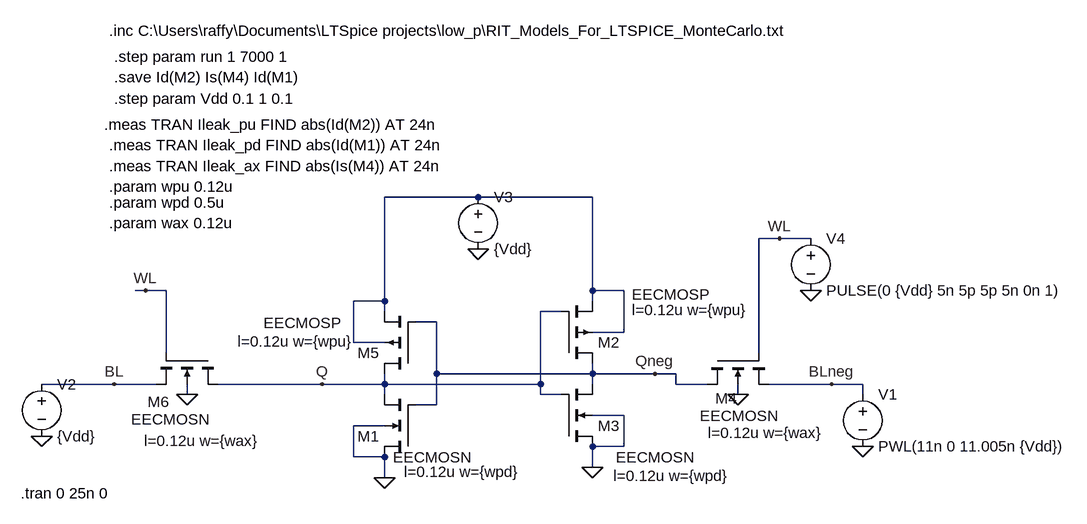
[diagram p0: schematic 6tcell_leak.asc]
6tcell_leak.asc, the LTspice schematic file:
Version 4
SHEET 1 1532 836
WIRE 624 112 480 112
WIRE 800 112 624 112
WIRE 1088 176 1056 176
WIRE 1136 176 1088 176
WIRE 112 256 96 256
WIRE 144 256 112 256
WIRE 800 256 800 112
WIRE 848 256 800 256
WIRE 480 272 480 112
WIRE 480 272 432 272
WIRE 800 272 800 256
WIRE 480 288 480 272
WIRE 752 288 720 288
WIRE 560 304 528 304
WIRE 848 320 848 256
WIRE 848 320 800 320
WIRE 432 336 432 272
WIRE 480 336 432 336
WIRE 144 352 144 256
WIRE 1056 352 1056 176
WIRE 560 384 560 304
WIRE 800 384 800 368
WIRE 800 384 560 384
WIRE 896 384 800 384
WIRE 928 384 896 384
WIRE 64 400 -48 400
WIRE 128 400 64 400
WIRE 384 400 224 400
WIRE 480 400 480 384
WIRE 480 400 384 400
WIRE 720 400 720 288
WIRE 720 400 480 400
WIRE 800 400 800 384
WIRE 928 400 928 384
WIRE 976 400 928 400
WIRE 1168 400 1072 400
WIRE 1216 400 1168 400
WIRE 176 416 176 400
WIRE 480 416 480 400
WIRE 720 416 720 400
WIRE 752 416 720 416
WIRE 1024 416 1024 400
WIRE 1216 416 1216 400
WIRE 560 432 560 384
WIRE 560 432 528 432
WIRE 848 448 800 448
WIRE 480 464 432 464
WIRE 848 496 848 448
WIRE 848 496 800 496
WIRE 432 512 432 464
WIRE 480 512 432 512
WIRE 800 528 800 496
WIRE 480 544 480 512
FLAG 112 256 WL
FLAG 624 192 0
FLAG 480 544 0
FLAG 800 528 0
FLAG 384 400 Q
FLAG 1216 496 0
FLAG 896 384 Qneg
FLAG 1136 256 0
FLAG 1088 176 WL
FLAG 1168 400 BLneg
FLAG 64 400 BL
FLAG -48 480 0
FLAG 176 416 0
FLAG 1024 416 0
SYMBOL voltage 1216 400 R0
WINDOW 123 0 0 Left 0
WINDOW 39 0 0 Left 0
SYMATTR InstName V1
SYMATTR Value PWL(11n 0 11.005n {Vdd})
SYMBOL voltage -48 384 R0
WINDOW 123 0 0 Left 0
WINDOW 39 0 0 Left 0
SYMATTR InstName V2
SYMATTR Value {Vdd}
SYMBOL voltage 624 96 R0
WINDOW 123 0 0 Left 0
WINDOW 39 0 0 Left 0
SYMATTR InstName V3
SYMATTR Value {Vdd}
SYMBOL voltage 1136 160 R0
WINDOW 123 0 0 Left 0
WINDOW 39 0 0 Left 0
SYMATTR InstName V4
SYMATTR Value PULSE(0 {Vdd} 5n 5p 5p 5n 0n 1)
SYMBOL pmos4 528 384 R180
WINDOW 3 115 78 Left 2
WINDOW 123 95 50 Left 2
SYMATTR Value EECMOSP
SYMATTR Value2 l=0.12u w={wpu}
SYMATTR InstName M5
SYMBOL pmos4 752 368 M180
WINDOW 3 109 106 Left 2
WINDOW 123 109 82 Left 2
SYMATTR Value EECMOSP
SYMATTR Value2 l=0.12u w={wpu}
SYMATTR InstName M2
SYMBOL nmos4 224 352 R90
WINDOW 0 75 75 VRight 2
WINDOW 3 102 13 VRight 2
WINDOW 123 135 -64 VRight 2
SYMATTR InstName M6
SYMATTR Value EECMOSN
SYMATTR Value2 l=0.12u w={wax}
SYMBOL nmos4 528 512 R180
WINDOW 3 -86 -1 Left 2
WINDOW 123 -161 -23 Left 2
SYMATTR Value EECMOSN
SYMATTR Value2 l=0.12u w={wpd}
SYMATTR InstName M1
SYMBOL nmos4 752 496 M180
WINDOW 3 84 -17 Left 2
WINDOW 123 80 -45 Left 2
SYMATTR Value EECMOSN
SYMATTR Value2 l=0.12u w={wpd}
SYMATTR InstName M3
SYMBOL nmos4 976 352 M90
WINDOW 0 70 47 VLeft 2
WINDOW 3 97 110 VLeft 2
WINDOW 123 123 179 VLeft 2
SYMATTR InstName M4
SYMATTR Value EECMOSN
SYMATTR Value2 l=0.12u w={wax}
TEXT 56 -144 Left 2 !.inc C:\\Users\\raffy\\Documents\\LTSpice projects\\low_p\\RIT_Models_For_LTSPICE_MonteCarlo.txt
TEXT 64 -40 Left 2 !.step param Vdd 0.1 1 0.1
TEXT 64 -104 Left 2 !.step param run 1 7000 1\n.save Id(M2) Is(M4) Id(M1)
TEXT -80 568 Left 2 !.tran 0 25n 0
TEXT 48 0 Left 2 !.meas TRAN Ileak_pu FIND abs(Id(M2)) AT 24n
TEXT 56 32 Left 2 !.meas TRAN Ileak_pd FIND abs(Id(M1)) AT 24n
TEXT 56 64 Left 2 !.meas TRAN Ileak_ax FIND abs(Is(M4)) AT 24n
TEXT 56 96 Left 2 !.param wpu 0.12u
TEXT 56 120 Left 2 !.param wpd 0.5u
TEXT 56 152 Left 2 !.param wax 0.12u

The netlist it stands for:
* 6tcell_leak.asc
V1 BLneg 0 PWL(11n 0 11.005n {Vdd})
V2 BL 0 {Vdd}
V3 N001 0 {Vdd}
V4 WL 0 PULSE(0 {Vdd} 5n 5p 5p 5n 0n 1)
M5 Q Qneg N001 N001 EECMOSP l=0.12u w={wpu}
M2 Qneg Q N001 N001 EECMOSP l=0.12u w={wpu}
M6 Q WL BL 0 EECMOSN l=0.12u w={wax}
M1 0 Qneg Q 0 EECMOSN l=0.12u w={wpd}
M3 0 Q Qneg 0 EECMOSN l=0.12u w={wpd}
M4 Qneg WL BLneg 0 EECMOSN l=0.12u w={wax}
.model NMOS NMOS
.model PMOS PMOS
.lib standard.mos
.inc C:\Users\raffy\Documents\LTSpice projects\low_p\RIT_Models_For_LTSPICE_MonteCarlo.txt
.step param Vdd 0.1 1 0.1
.step param run 1 7000 1
.save Id(M2) Is(M4) Id(M1)
.tran 0 25n 0
.meas TRAN Ileak_pu FIND abs(Id(M2)) AT 24n
.meas TRAN Ileak_pd FIND abs(Id(M1)) AT 24n
.meas TRAN Ileak_ax FIND abs(Is(M4)) AT 24n
.param wpu 0.12u
.param wpd 0.5u
.param wax 0.12u
.backanno
.end